# Altium schematic sheet projet_pcb_etu_PIC18.SchDoc
size A3
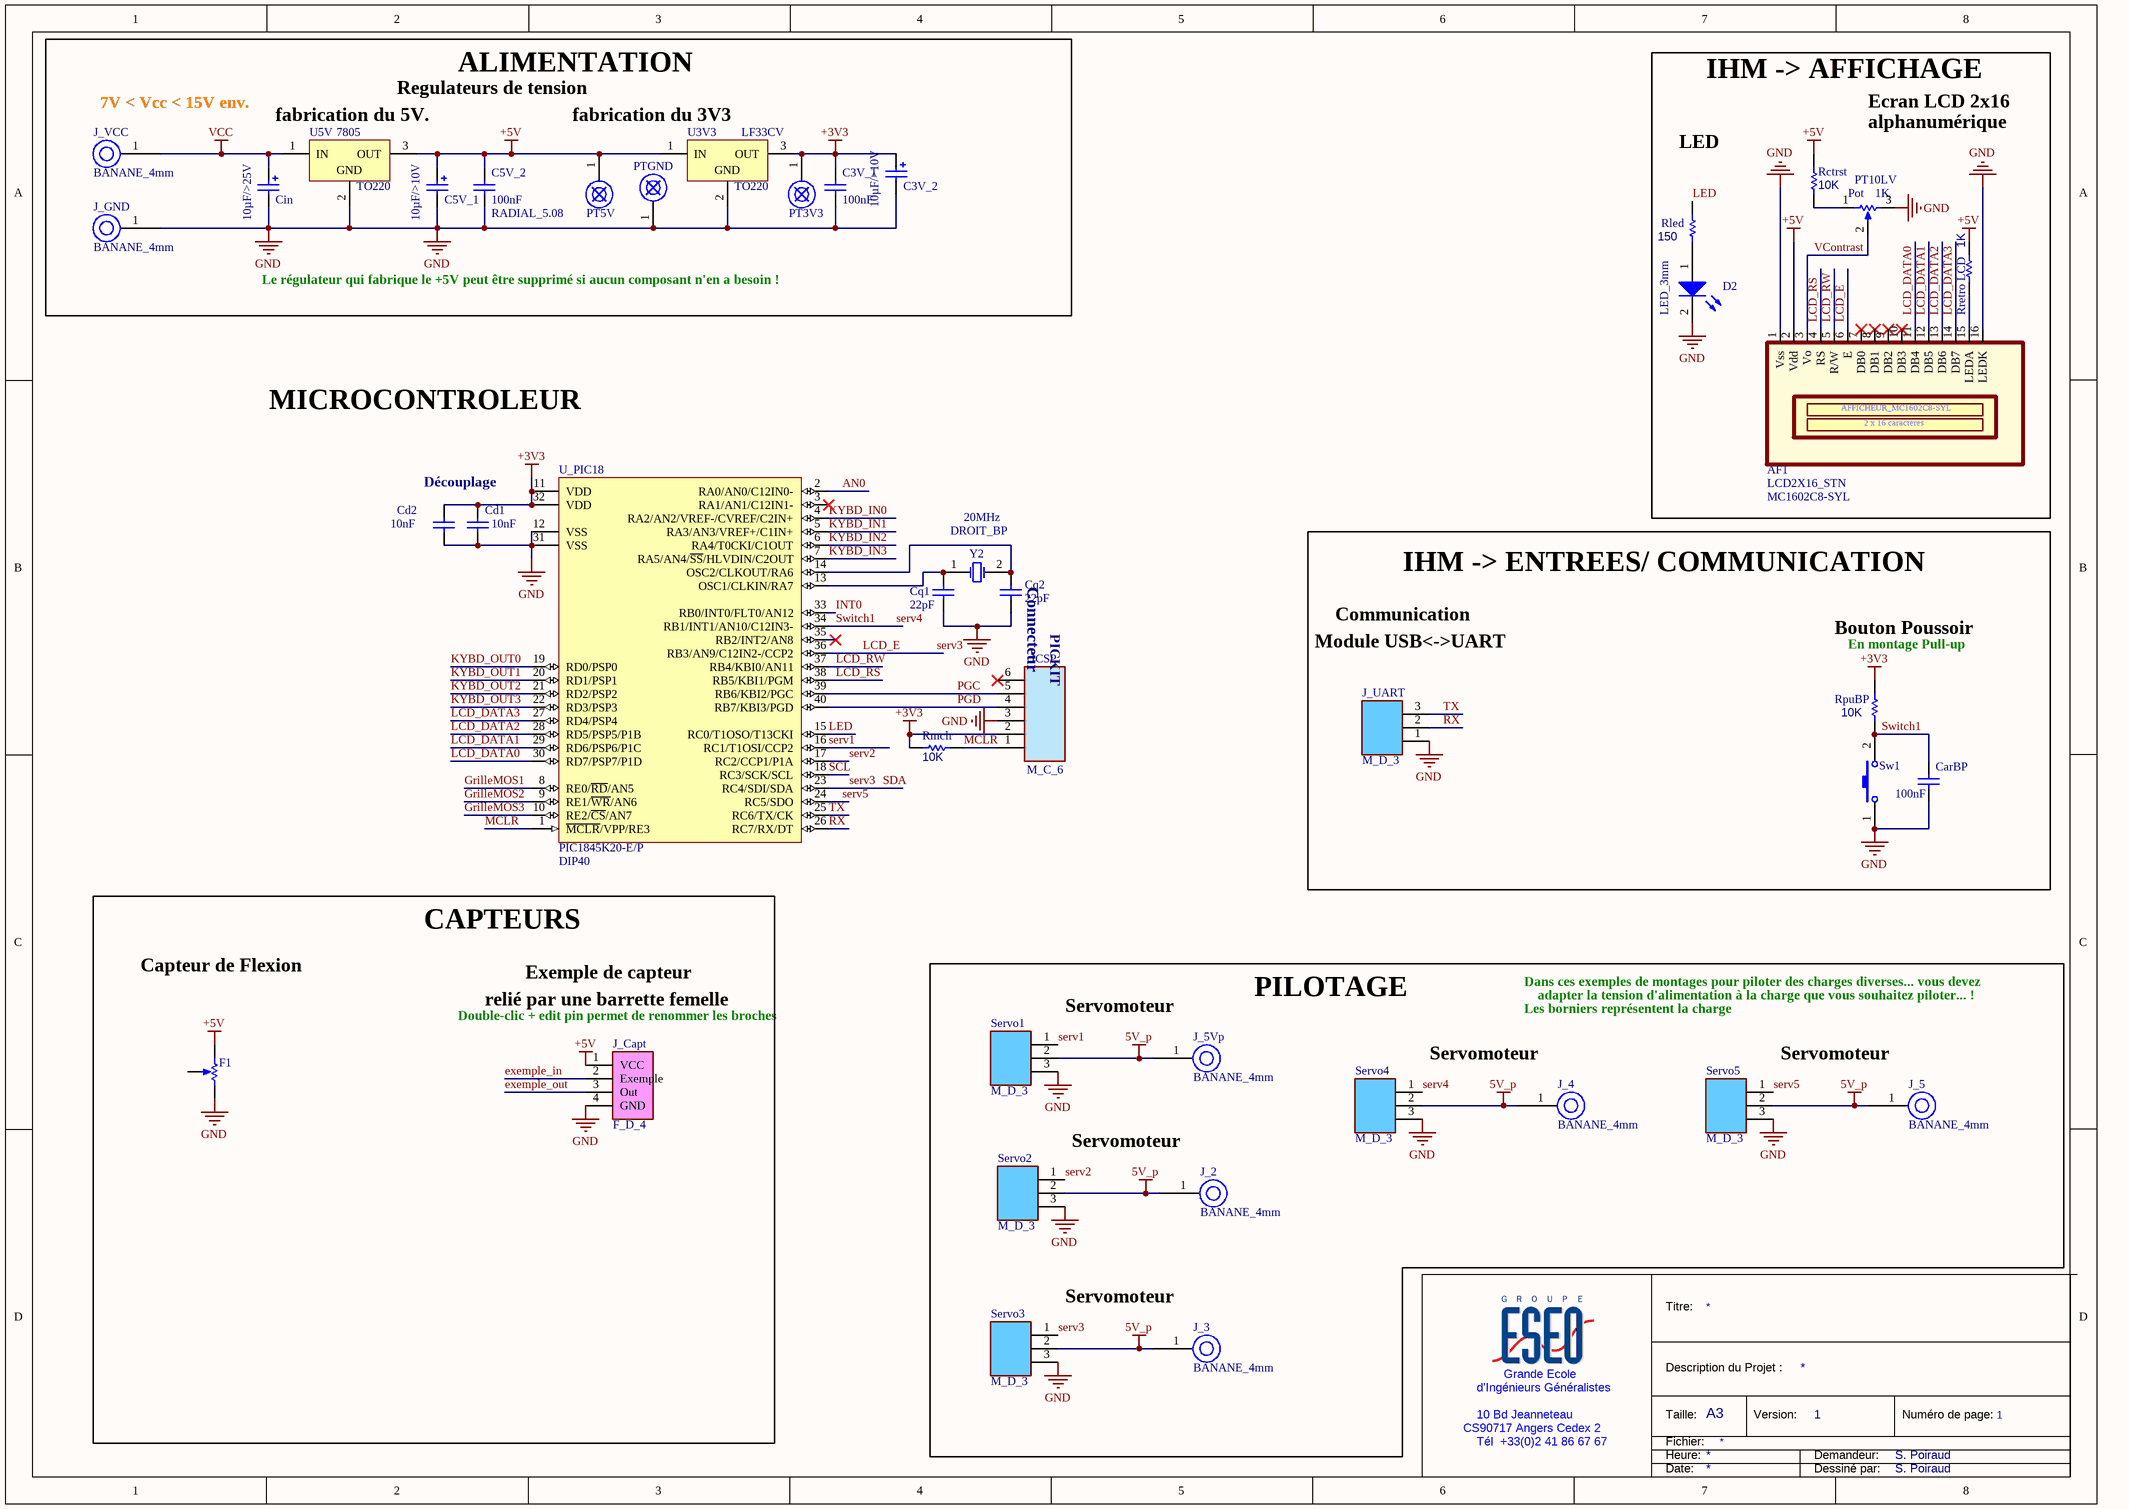
[diagram p0: projet_pcb_etu_PIC18.SchDoc]

## Parts
AF1  Type: LCD2X16_STN  Name: MC1602C8-SYL  [AFFICHEUR_LCD_MC1602C8-SYL]  (hidden comment: AFFICHEUR_LCD_2X16_)
C3V_1  value 100nF  [CONDENSATEUR_CERAMIQUE_RADIAL_5.08]  (hidden comment: CONDENSATEUR_CER_RAD_5.08)
C3V_2  value 10µF/>10V  [CONDENSATEUR_POLARISE_ELECTROLYTIQUE_RADIAL_2.0/5.08]  (hidden comment: CONDENSATEUR_POL_ELECTROLY_RAD_2.0/5.08)
C5V_1  value 10µF/>10V  [CONDENSATEUR_POLARISE_ELECTROLYTIQUE_RADIAL_2.0/5.08]  (hidden comment: CONDENSATEUR_POL_ELECTROLY_RAD_2.0/5.08)
C5V_2  value 100nF  Type: RADIAL_5.08  [CONDENSATEUR_CERAMIQUE_RADIAL_5.08]  (hidden comment: CONDENSATEUR_CER_RAD_5.08)
CarBP  value 100nF  [CONDENSATEUR_CERAMIQUE_RADIAL_5.08]  (hidden comment: CONDENSATEUR_CER_RAD_5.08)
Cd1  value 10nF  [CONDENSATEUR_CERAMIQUE_RADIAL_5.08]  (hidden comment: CONDENSATEUR_CER_RAD_5.08)
Cd2  value 10nF  [CONDENSATEUR_CERAMIQUE_RADIAL_5.08]  (hidden comment: CONDENSATEUR_CER_RAD_5.08)
Cin  value 10µF/>25V  [CONDENSATEUR_POLARISE_ELECTROLYTIQUE_RADIAL_2.0/5.08]  (hidden comment: CONDENSATEUR_POL_ELECTROLY_RAD_2.0/5.08)
Cq1  value 22pF  [CONDENSATEUR_CERAMIQUE_RADIAL_5.08]  (hidden comment: CONDENSATEUR_CER_RAD_5.08)
Cq2  value 22pF  [CONDENSATEUR_CERAMIQUE_RADIAL_5.08]  (hidden comment: CONDENSATEUR_CER_RAD_5.08)
D2  LED_3MM  [LED_3MM]
F1  Potentiometer  (value not drawn)
ICSP  Type: M_C_6  [BARRETTE_6_M_C]  (hidden comment: BARRETTE_6 CONTACTS_1 RANGEE_MALE_COUDEE)
J_2  Type: BANANE_4mm  [DOUILLE_BANANE_4mm]  (hidden comment: DOUILLE BANANE 4mm)
J_3  Type: BANANE_4mm  [DOUILLE_BANANE_4mm]  (hidden comment: DOUILLE BANANE 4mm)
J_4  Type: BANANE_4mm  [DOUILLE_BANANE_4mm]  (hidden comment: DOUILLE BANANE 4mm)
J_5  Type: BANANE_4mm  [DOUILLE_BANANE_4mm]  (hidden comment: DOUILLE BANANE 4mm)
J_5Vp  Type: BANANE_4mm  [DOUILLE_BANANE_4mm]  (hidden comment: DOUILLE BANANE 4mm)
J_Capt  Type: F_D_4  [BARRETTE_4_F_D]  (hidden comment: BARRETTE_4 CONTACTS_1 RANGEE_FEMELLE_DROITE)
J_GND  Type: BANANE_4mm  [DOUILLE_BANANE_4mm]  (hidden comment: DOUILLE BANANE 4mm)
J_UART  Type: M_D_3  [BARRETTE_3_M_D]  (hidden comment: BARRETTE 3 CONTACTS 1 RANGEE MALE DROITE)
J_VCC  Type: BANANE_4mm  [DOUILLE_BANANE_4mm]  (hidden comment: DOUILLE BANANE 4mm)
Pot  value 1K  Type: PT10LV  [TRIMMER_MONOTOUR_PT10LV]  (hidden comment: RESISTANCE_VARIABLE_TRAVERSANTE : PT10LV)
PT3V3  POINT_TEST  [POINT_TEST]  (value not drawn)
PT5V  POINT_TEST  [POINT_TEST]  (value not drawn)
PTGND  POINT_TEST  [POINT_TEST]  (value not drawn)
Rctrst  value 10K  [RESISTANCE_1/4W]  (hidden comment: RESISTANCE_AXIALE_1/4W)
Rled  value 150  [RESISTANCE_1/4W]  (hidden comment: RESISTANCE_AXIALE_1/4W)
Rmclr  value 10K  [RESISTANCE_1/4W]  (hidden comment: RESISTANCE_AXIALE_1/4W)
RpuBP  value 10K  [RESISTANCE_1/4W]  (hidden comment: RESISTANCE_AXIALE_1/4W)
Rretro_LCD  value 1K  [RESISTANCE_1/4W]  (hidden comment: RESISTANCE_AXIALE_1/4W)
Servo1  Type: M_D_3  [BARRETTE_3_M_D]  (hidden comment: BARRETTE 3 CONTACTS 1 RANGEE MALE DROITE)
Servo2  Type: M_D_3  [BARRETTE_3_M_D]  (hidden comment: BARRETTE 3 CONTACTS 1 RANGEE MALE DROITE)
Servo3  Type: M_D_3  [BARRETTE_3_M_D]  (hidden comment: BARRETTE 3 CONTACTS 1 RANGEE MALE DROITE)
Servo4  Type: M_D_3  [BARRETTE_3_M_D]  (hidden comment: BARRETTE 3 CONTACTS 1 RANGEE MALE DROITE)
Servo5  Type: M_D_3  [BARRETTE_3_M_D]  (hidden comment: BARRETTE 3 CONTACTS 1 RANGEE MALE DROITE)
Sw1  BOUTON_POUSSOIR_MINIATURE_TRAVERSANT  [BOUTON_POUSSE_PLAT_6x6]  (value not drawn)
U3V3  Type: LF33CV  Package: TO220  [REGULATEUR_TO220_78XX]  (hidden comment: REGULATEUR_TO220_78XX)
U5V  Type: 7805  Package: TO220  [REGULATEUR_TO220_78XX]  (hidden comment: REGULATEUR_TO220_78XX)
U_PIC18  Type: PIC1845K20-E/P  Package: DIP40  [DIP40_PAS=2.54_LARG=15.24_LONG=52.5]  (hidden comment: PIC18F45K20-E/P_DIP40)
Y2  value 20MHz  Type: DROIT_BP  [QUARTZ_DROIT_BP]  (hidden comment: QUARTZ_DROIT_BAS_PROFIL)

## Blocks framed on the sheet
ALIMENTATION: C3V_1 C3V_2 C5V_1 C5V_2 Cin J_GND J_VCC PT3V3 PT5V PTGND U3V3 U5V
IHM -> AFFICHAGE: AF1 D2 Pot Rctrst Rled Rretro_LCD
IHM -> ENTREES/ COMMUNICATION: CarBP J_UART RpuBP Sw1
CAPTEURS: F1 J_Capt
PILOTAGE: J_2-J_5 J_5Vp Servo1-Servo5

## Nets
5V_p: J_2.1 J_3.1 J_4.1 J_5.1 J_5Vp.1 Servo1.2 Servo2.2 Servo3.2 Servo4.2 Servo5.2
+3V3: C3V_1.2 C3V_2.1 Cd1.2 Cd2.2 ICSP.2 PT3V3.1 Rmclr.2 RpuBP.1 U3V3.3(OUT) U_PIC18.11(VDD) U_PIC18.32(VDD)
+5V: AF1.2(Vdd) C5V_1.1 C5V_2.2 F1.1(TOP) J_Capt.1(VCC) PT5V.1 Rctrst.1 Rretro_LCD.1 U3V3.1(IN) U5V.3(OUT)
GND: AF1.1(Vss) AF1.16(LEDK) C3V_1.1 C3V_2.2 C5V_1.2 C5V_2.1 CarBP.1 Cd1.1 Cd2.1 Cin.2 Cq1.2 Cq2.2 D2.2 F1.2(BOT) ICSP.3 J_Capt.4(GND) J_GND.1 J_UART.1 Pot.3 PTGND.1 Servo1.3 Servo2.3 Servo3.3 Servo4.3 Servo5.3 Sw1.1 U3V3.2(GND) U5V.2(GND) U_PIC18.12(VSS) U_PIC18.31(VSS)
VCC: Cin.1 J_VCC.1 U5V.1(IN)
AN0: U_PIC18.2(RA0/AN0/C12IN0-)
exemple_in: J_Capt.2(Exemple)
exemple_out: J_Capt.3(Out)
GrilleMOS1: U_PIC18.8(RE0/~{RD}/AN5)
GrilleMOS2: U_PIC18.9(RE1/~{WR}/AN6)
GrilleMOS3: U_PIC18.10(RE2/~{CS}/AN7)
INT0: U_PIC18.33(RB0/INT0/FLT0/AN12)
KYBD_IN0: U_PIC18.4(RA2/AN2/VREF-/CVREF/C2IN+)
KYBD_IN1: U_PIC18.5(RA3/AN3/VREF+/C1IN+)
KYBD_IN2: U_PIC18.6(RA4/T0CKI/C1OUT)
KYBD_IN3: U_PIC18.7(RA5/AN4/~{SS}/HLVDIN/C2OUT)
KYBD_OUT0: U_PIC18.19(RD0/PSP0)
KYBD_OUT1: U_PIC18.20(RD1/PSP1)
KYBD_OUT2: U_PIC18.21(RD2/PSP2)
KYBD_OUT3: U_PIC18.22(RD3/PSP3)
LCD_DATA0: AF1.11(DB4) U_PIC18.30(RD7/PSP7/P1D)
LCD_DATA1: AF1.12(DB5) U_PIC18.29(RD6/PSP6/P1C)
LCD_DATA2: AF1.13(DB6) U_PIC18.28(RD5/PSP5/P1B)
LCD_DATA3: AF1.14(DB7) U_PIC18.27(RD4/PSP4)
LCD_E: AF1.6(E) Servo3.1 U_PIC18.23(RC4/SDI/SDA) U_PIC18.36(RB3/AN9/C12IN2-/CCP2)  [also labelled SDA, serv3]
LCD_RS: AF1.4(RS) U_PIC18.38(RB5/KBI1/PGM)
LCD_RW: AF1.5(R/W) U_PIC18.37(RB4/KBI0/AN11)
LED: Rled.1 U_PIC18.15(RC0/T1OSO/T13CKI)
MCLR: ICSP.1 Rmclr.1 U_PIC18.1(~{MCLR}/VPP/RE3)
PGC: ICSP.5 U_PIC18.39(RB6/KBI2/PGC)
PGD: ICSP.4 U_PIC18.40(RB7/KBI3/PGD)
RX: J_UART.2 U_PIC18.26(RC7/RX/DT)
SCL: U_PIC18.18(RC3/SCK/SCL)
serv1: Servo1.1 U_PIC18.16(RC1/T1OSI/CCP2)
serv2: Servo2.1 U_PIC18.17(RC2/CCP1/P1A)
serv4: CarBP.2 RpuBP.2 Servo4.1 Sw1.2 U_PIC18.34(RB1/INT1/AN10/C12IN3-)  [also labelled Switch1]
serv5: Servo5.1 U_PIC18.24(RC5/SDO)
TX: J_UART.3 U_PIC18.25(RC6/TX/CK)
VContrast: AF1.3(Vo) Pot.2
NetAF1_15: AF1.15(LEDA) Rretro_LCD.2
NetCq1_1: Cq1.1 U_PIC18.13(OSC1/CLKIN/RA7) Y2.1(OSC1)
NetCq2_1: Cq2.1 U_PIC18.14(OSC2/CLKOUT/RA6) Y2.2(OSC2)
NetD2_1: D2.1 Rled.2
NetPot_1: Pot.1 Rctrst.2

Not connected (* = marked no-connect by the designer): AF1 7(DB0)* 8(DB1)* 9(DB2)* 10(DB3)*; F1 3(TAP); ICSP 6*; U_PIC18 3(RA1/AN1/C12IN1-)* 35(RB2/INT2/AN8)*

## Notes on the sheet
- 7V < Vcc < 15V env.
- Regulateurs de tension
- Ecran LCD 2x16
- (near U5V) fabrication du 5V.
- (near U3V3) fabrication du 3V3
- LED
- alphanumérique
- Le régulateur qui fabrique le +5V peut être supprimé si aucun composant n'en a besoin !
- MICROCONTROLEUR
- Découplage
- Module USB<->UART
- Communication
- Bouton Poussoir
- (near RpuBP) En montage Pull-up
- Capteur de Flexion
- Exemple de capteur
- Dans ces exemples de montages pour piloter des charges diverses... vous devez
- (near J_Capt) Double-clic + edit pin permet de renommer les broches
- relié par une barrette femelle
- Servomoteur
- Les borniers représentent la charge
- adapter la tension d'alimentation à la charge que vous souhaitez piloter... !
- Titre:
- d'Ingénieurs Généralistes
- Grande Ecole
- Description du Projet :
- *
- CS90717 Angers Cedex 2
- 10 Bd Jeanneteau
- Tél  +33(0)2 41 86 67 67
- Taille:
- Heure:
- Fichier:
- A3
- Version:
- 1
- Demandeur:
- S. Poiraud
- Numéro de page:
- Date:
- Dessiné par:
- (in symbol AFFICHEUR_LCD_MC1602C8-SYL) AFFICHEUR_MC1602C8-SYL; 2 x 16 caractères
- (in symbol BARRETTE_6 CONTACTS_1 RANGEE_MALE_COUDEE) Connecteur; PICKIT

## Library data of the parts
AF1 = AFFICHEUR_LCD_MC1602C8-SYL: AFFICHEUR LCD - 2x16 LIGNES - 5X7 DOTS - STN - 80mm x 36mm
C3V_1 = CONDENSATEUR_CER_RAD_5.08: CONDENSATEUR TRAVERSANT CERAMIQUE RADIAL 5.08mm; Type: RADIAL_5.08
C3V_2 C5V_1 = CONDENSATEUR_POL_ELECTROLY_RAD_2.0/5.08: CONDENSATEUR POLARISE ELECTROLYTIQUE RADIAL 2.0/5.08; Type: POL_RAD_2.0/5.08
C5V_2 CarBP Cd1 Cd2 Cq1 Cq2 = CONDENSATEUR_CER_RAD_5.08: CONDENSATEUR TRAVERSANT CERAMIQUE RADIAL 5.08mm
  CarBP Cd1 Cd2 Cq1 Cq2: Type: RADIAL_5.08
Cin = CONDENSATEUR_POL_ELECTROLY_RAD_2.0/5.08: CONDENSATEUR POLARISE ELECTROLYTIQUE RADIAL 2.0/5.08; Type: POL_RAD_2.0/5.08
D2 = LED_3MM: LED 3MM - ROUGE/VERTE/JAUNE; Type: LED_3mm
F1 = Potentiometer: value: 1k; position: 0.5; SimulationGenericComponent: True
ICSP = BARRETTE_6 CONTACTS_1 RANGEE_MALE_COUDEE: BARRETTE 6 CONTACTS 1 RANGEE MALE COUDEE
J_2-J_5 J_5Vp J_GND J_VCC = DOUILLE_BANANE_4mm: DOUILLE BANANE 4 mm
J_Capt = BARRETTE_4 CONTACTS_1 RANGEE_FEMELLE_DROITE: BARRETTE 4 CONTACTS 1 RANGEE FEMELLE DROITE
J_UART Servo1-Servo5 = BARRETTE_3 CONTACTS_1 RANGEE_MALE_DROITE
Pot = RESISTANCE_VARIABLE_TRAVERSANTE : PT10LV: RESISTANCE VARIABLE_TRAVERSANTE : PT10LV
PT3V3 PT5V PTGND = POINT_TEST: POINT TEST
Rctrst Rled Rmclr RpuBP Rretro_LCD = RESISTANCE_AXIALE_1/4W: RESISTANCE TRAVERSANTE AXIALE 1/4W; Type: 1/4W
Sw1 = BOUTON_POUSSOIR_MINIATURE_TRAVERSANT: BOUTON POUSSOIR MINIATURE TRAVERSANT ON/OFF; Type: B_POUSS_MINI_T
U3V3 U5V = REGULATEUR_TO220_78XX: REGULATEUR DE TENSION POSITIVE 78XX BOITIER TO220
U_PIC18 = PIC18F45K20-E/P_DIP40: MICROCONTROLEUR 8 BITS - 36I/O - 32KO : FLASH - 16KMOTS : MEMOIRE PROG - 4 TIMERS - 256 OCTETS : EEPROM -
Y2 = QUARTZ_DROIT_BAS_PROFIL: QUARTZ DROIT BAS PROFIL